# Altium schematic sheet HBridge.SchDoc: H Bridge
size Letter; DocumentNumber: 2; SheetNumber: 2; SheetTotal: 4
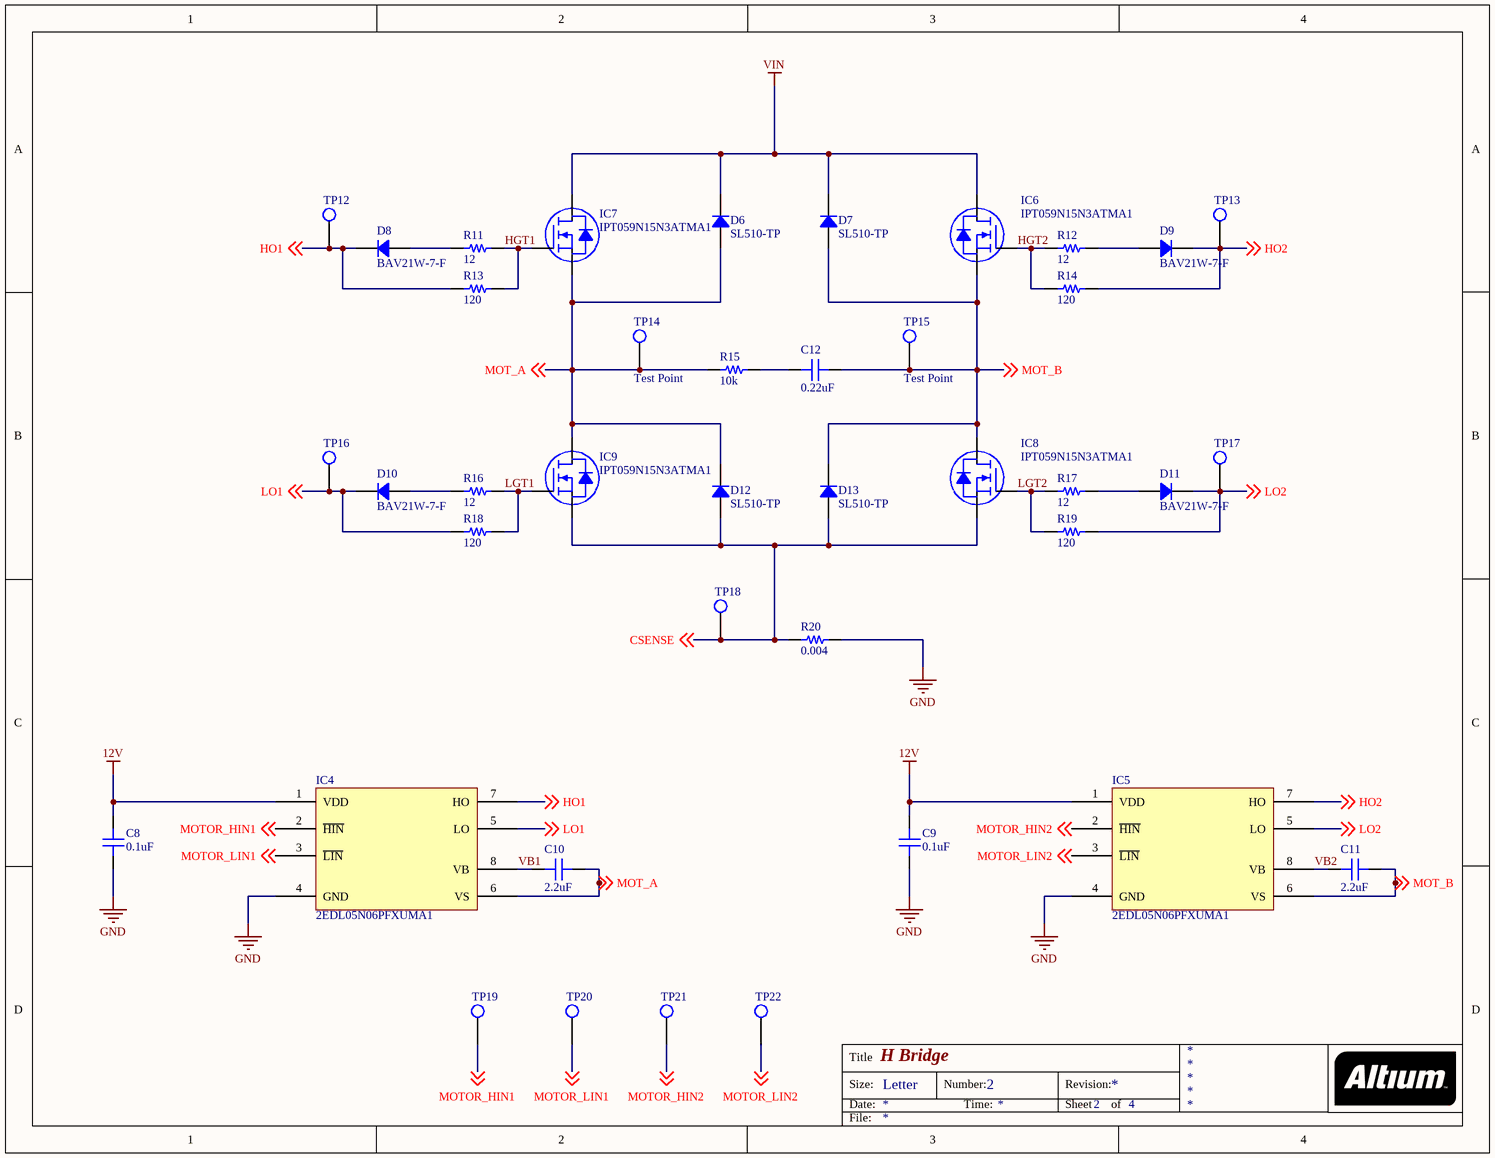
[diagram p0: HBridge.SchDoc]

## Parts
C8  0.1uF  [CAP 0603/1608]
C9  0.1uF  [CAP 0603/1608]
C10  2.2uF  [CAP 0805/2012]
C11  2.2uF  [CAP 0805/2012]
C12  0.22uF  [CAP 1206/3216]
D6  SL510-TP  [ST DO214AB SMC]
D7  SL510-TP  [ST DO214AB SMC]
D8  BAV21W-7-F  [SOD-123]
D9  BAV21W-7-F  [SOD-123]
D10  BAV21W-7-F  [SOD-123]
D11  BAV21W-7-F  [SOD-123]
D12  SL510-TP  [ST DO214AB SMC]
D13  SL510-TP  [ST DO214AB SMC]
IC4  2EDL05N06PFXUMA1  [Infineon PG-DSO-8]
IC5  2EDL05N06PFXUMA1  [Infineon PG-DSO-8]
IC6  IPT059N15N3ATMA1  [INFINEON PG-HSOF-8-1]
IC7  IPT059N15N3ATMA1  [INFINEON PG-HSOF-8-1]
IC8  IPT059N15N3ATMA1  [INFINEON PG-HSOF-8-1]
IC9  IPT059N15N3ATMA1  [INFINEON PG-HSOF-8-1]
R11  12  [RES 1206/3216]
R12  12  [RES 1206/3216]
R13  120  [RES 1206/3216]
R14  120  [RES 1206/3216]
R15  10k  [RES 0805/2012]
R16  12  [RES 1206/3216]
R17  12  [RES 1206/3216]
R18  120  [RES 1206/3216]
R19  120  [RES 1206/3216]
R20  0.004  [STACKPOLE CSR2512]
TP12  Test Point  [Test Point]  (value not drawn)  (no BOM)
TP13  Test Point  [Test Point]  (value not drawn)  (no BOM)
TP14  Test Point  [Test Point]  (no BOM)
TP15  Test Point  [Test Point]  (no BOM)
TP16  Test Point  [Test Point]  (value not drawn)  (no BOM)
TP17  Test Point  [Test Point]  (value not drawn)  (no BOM)
TP18  Test Point  [Test Point]  (value not drawn)  (no BOM)
TP19  Test Point  [Test Point]  (value not drawn)  (no BOM)
TP20  Test Point  [Test Point]  (value not drawn)  (no BOM)
TP21  Test Point  [Test Point]  (value not drawn)  (no BOM)
TP22  Test Point  [Test Point]  (value not drawn)  (no BOM)

## Nets
12V: C8.2 C9.2 IC4.1(VDD) IC5.1(VDD)
GND: C8.1 C9.1 IC4.4(GND) IC5.4(GND) R20.2
VIN: D6.2 D7.2 IC6.D IC7.D
CSENSE: D12.1 D13.1 IC8.S IC9.S R20.1 TP18.1(TP) ; off-sheet CSENSE
HGT1: IC7.G R11.2 R13.2
HGT2: IC6.G R12.1 R14.1
HO1: D8.2 IC4.7(HO) R13.1 TP12.1(TP) ; off-sheet HO1
HO2: D9.2 IC5.7(HO) R14.2 TP13.1(TP) ; off-sheet HO2
LGT1: IC9.G R16.2 R18.2
LGT2: IC8.G R17.1 R19.1
LO1: D10.2 IC4.5(LO) R18.1 TP16.1(TP) ; off-sheet LO1
LO2: D11.2 IC5.5(LO) R19.2 TP17.1(TP) ; off-sheet LO2
MOT_A: C10.1 D6.1 D12.2 IC4.6(VS) IC7.S IC9.D R15.1 TP14.1(TP) ; off-sheet MOT_A
MOT_B: C11.1 C12.2 D7.1 D13.2 IC5.6(VS) IC6.S IC8.D TP15.1(TP) ; off-sheet MOT_B
MOTOR_HIN1: IC4.2(~{HIN}) TP19.1(TP) ; off-sheet MOTOR_HIN1
MOTOR_HIN2: IC5.2(~{HIN}) TP21.1(TP) ; off-sheet MOTOR_HIN2
MOTOR_LIN1: IC4.3(~{LIN}) TP20.1(TP) ; off-sheet MOTOR_LIN1
MOTOR_LIN2: IC5.3(~{LIN}) TP22.1(TP) ; off-sheet MOTOR_LIN2
VB1: C10.2 IC4.8(VB)
VB2: C11.2 IC5.8(VB)
NetC12_1: C12.1 R15.2
NetD8_1: D8.1 R11.1
NetD9_1: D9.1 R12.2
NetD10_1: D10.1 R16.1
NetD11_1: D11.1 R17.2

## Notes on the sheet
- Title
- Size:
- Date:
- Letter
- Number:
- Time:
- Revision:
- Sheet
- of
- File:

## Library data of the parts
C8 C9 = CC0603KPX7R7BB104: CAP CER 0.1UF 16V X7R 0603; Manufacturer: Yageo; TemperatureRange: -55C ~ 125C; Tolerance: 10%; Value: 0.1uF; Part Number: CC0603KPX7R7BB104; PartId: 5262; Supplier 1: Digi-Key; Supplier Part Number 1: 311-1335-2-ND; ComponentLink1Description: Datasheet; ComponentLink1URL: http://www.yageo.com/documents/recent/UPY-GPHC_X7R_6.3V-to-50V-v12.pdf; ComponentLink2Description: Digi-Key listing; ComponentLink2URL: http://digikey.com/product-detail/en/CC0603KPX7R7BB104/311-1335-2-ND/2103073; TemperatureCoefficient: X7R; Voltage: 16V; Price: 0.0043; Type: -; Device Package: 0603 (1608 Metric)
C10 C11 = GRM219C81E225KE15D: CAP CER 2.2UF 25V X6S 0805; Manufacturer: Murata Electronics North America; TemperatureRange: -55C ~ 105C; Tolerance: 10%; Value: 2.2uF; Part Number: GRM219C81E225KE15D; PartId: 13974; Supplier 1: Digi-Key; Supplier Part Number 1: 490-7206-2-ND; ComponentLink1Description: Datasheet; ComponentLink1URL: http://www.murata.com/~/media/webrenewal/support/library/catalog/products/capacitor/mlcc/c02e.pdf; ComponentLink2Description: Digi-Key Listing; ComponentLink2URL: https://www.digikey.com/product-detail/en/murata-electronics-north-america/GRM219C81E225KE15D/490-7206-2-ND/3900464; TemperatureCoefficient: X6S; Voltage: 25V; Price: 0.0334; Device Package: 0805 (2012 Metric)
C12 = C3216X7T2E224K160AA: CAP CER 0.22UF 250V X7T 1206; Manufacturer: TDK Corporation; TemperatureRange: -55C ~ 125C; Tolerance: 10%; Value: 0.22uF; Part Number: C3216X7T2E224K160AA; PartId: 14974; Supplier 1: Digi-Key; Supplier Part Number 1: 445-7756-2-ND; ComponentLink1Description: Datasheet; ComponentLink1URL: https://product.tdk.com/info/en/catalog/datasheets/mlcc_commercial_midvoltage_en.pdf; ComponentLink2Description: Digi-Key Listing; ComponentLink2URL: https://www.digikey.com/product-detail/en/tdk-corporation/C3216X7T2E224K160AA/445-7756-2-ND/2733191; TemperatureCoefficient: X7T; Voltage: 250V; Price: 0.099; Device Package: 1206 (3216 Metric)
D6 D7 D12 D13 = SL510-TP: DIODE SCHOTTKY 100V 5A DO214AB; Manufacturer: Micro Commercial Co; Current Reverse Leakage @ Vr: 500uA @ 100V; Voltage Forward (Vf): 700mV @ 5A; Part Number: SL510-TP; PartId: 27860; Supplier 1: Digi-Key; Supplier Part Number 1: SL510-TPMSCT-ND; ComponentLink1Description: Datasheet; ComponentLink1URL: http://www.mccsemi.com/up_pdf/SL54~SL510(DO-214AB)-A.pdf; ComponentLink2Description: Digi-Key Listing; ComponentLink2URL: https://www.digikey.com/product-detail/en/micro-commercial-co/SL510-TP/SL510-TPMSCT-ND/6004849; Junction Operating Temperature: -55C ~ 150C; Price: 0.74; Type: Schottky; Device Package: DO-214AB, SMC; Voltage DC Reverse (Vr): 100V; Current Rectified: 5A
D8-D11 = BAV21W-7-F: DIODE GEN PURP 200V 200MA SOD123; Manufacturer: Diodes Incorporated; Type: Standard; Current Reverse Leakage @ Vr: 100nA @ 200V; Reverse Recovery Time (trr): 50ns; Voltage Forward (Vf): 1.25V @ 200mA; Part Number: BAV21W-7-F; PartId: 14590; Supplier 1: Digi-Key; Supplier Part Number 1: BAV21W-FDITR-ND; ComponentLink1Description: Datasheet; ComponentLink1URL: http://www.diodes.com/_files/datasheets/ds12024.pdf; ComponentLink2Description: Digi-Key Listing; ComponentLink2URL: https://www.digikey.com/product-detail/en/diodes-incorporated/BAV21W-7-F/BAV21W-FDITR-ND/717710; Junction Operating Temperature: -65C ~ 150C; Price: 0.0318; Device Package: SOD-123; Voltage DC Reverse (Vr): 200V; Current Rectified: 200mA
IC4 IC5 = 2EDL05N06PFXUMA1: IC DRIVER GATE HALF BRIDGE 8DSO; Manufacturer: Infineon Technologies; Voltage - Supply: 10 V ~ 20 V; Part Number: 2EDL05N06PFXUMA1; PartId: 21206; Supplier 1: Digi-Key; Supplier Part Number 1: 2EDL05N06PFXUMA1TR-ND; ComponentLink1Description: Datasheet; ComponentLink1URL: http://www.infineon.com/dgdl/Infineon-2EDL05x06xx-DS-v02_05-EN.pdf?fileId=db3a30433e30e4bf013e3c649ffd6c8b; ComponentLink2Description: Digi-Key Listing; ComponentLink2URL: http://www.digikey.com/product-detail/en/infineon-technologies/2EDL05N06PFXUMA1/2EDL05N06PFXUMA1TR-ND/4571868?; Price: 0.5782; Device Package: 8-SOIC (0.154", 3.90mm Width)
IC6-IC9 = IPT059N15N3ATMA1: MOSFET N-CH 150V 155A 8HSOF; Manufacturer: Infineon Technologies; Rds On (Max) at Id, Vgs: 5.9 mOhm @ 150A, 10V; Vgs(th) (Max) at Id: 4V @ 270uA; Current Continuous Drain: 155A (Tc); Part Number: IPT059N15N3ATMA1; PartId: 21207; Supplier 1: Digi-Key; Supplier Part Number 1: IPT059N15N3ATMA1CT-ND; ComponentLink1Description: Datasheet; ComponentLink1URL: http://www.infineon.com/dgdl/IPT059N15N3+G_Rev1.1.pdf?folderId=db3a304326623792012669f6bee2224b&fileId=db3a30433e9d5d11013e9e62778d0185; ComponentLink2Description: Digi-Key Listing; ComponentLink2URL: http://www.digikey.ca/product-detail/en/infineon-technologies/IPT059N15N3ATMA1/IPT059N15N3ATMA1CT-ND/4571880; Price: 9.27; Type: N-Channel; Device Package: 8-PowerSFN; Drain to Source Voltage (Vdss): 150V; Features: -
R11 R12 R16 R17 = ERJ-8GEYJ120V: RES SMD 12 OHM 5% 1/4W 1206; Manufacturer: Panasonic Electronic Components; TemperatureRange: -55C ~ 155C; TemperatureCoefficient: 200ppm/C; PowerRating: 0.25W, 1/4W; Value: 12; Part Number: ERJ-8GEYJ120V; PartId: 11899; Supplier 1: Digi-Key; Supplier Part Number 1: P12ETR-ND; ComponentLink1Description: Datasheet; ComponentLink1URL: http://industrial.panasonic.com/www-cgi/jvcr13pz.cgi?E+PZ+3+AOA0001+ERJ8GEYJ120V+7+WW; ComponentLink2Description: Digi-Key Listing; ComponentLink2URL: https://www.digikey.com/product-detail/en/panasonic-electronic-components/ERJ-8GEYJ120V/P12ETR-ND/16119; Tolerance: 5%; Price: 0.0045; Device Package: 1206 (3216 Metric)
R13 R14 R18 R19 = ERJ-8GEYJ121V: RES SMD 120 OHM 5% 1/4W 1206; Manufacturer: Panasonic Electronic Components; TemperatureRange: -55C ~ 155C; TemperatureCoefficient: 200ppm/C; PowerRating: 0.25W, 1/4W; Value: 120; Part Number: ERJ-8GEYJ121V; PartId: 11834; Supplier 1: Digi-Key; Supplier Part Number 1: P120ETR-ND; ComponentLink1Description: Datasheet; ComponentLink1URL: http://industrial.panasonic.com/www-cgi/jvcr13pz.cgi?E+PZ+3+AOA0001+ERJ8GEYJ121V+7+WW; ComponentLink2Description: Digi-Key Listing; ComponentLink2URL: https://www.digikey.com/product-detail/en/panasonic-electronic-components/ERJ-8GEYJ121V/P120ETR-ND/1567; Tolerance: 5%; Price: 0.0045; Device Package: 1206 (3216 Metric)
R15 = ERJ-6GEYJ103V: RES SMD 10K OHM 5% 1/8W 0805; Manufacturer: Panasonic Electronic Components; TemperatureRange: -55C ~ 155C; TemperatureCoefficient: 200ppm/C; PowerRating: 0.125W, 1/8W; Value: 10k; Part Number: ERJ-6GEYJ103V; PartId: 11441; Supplier 1: Digi-Key; Supplier Part Number 1: P10KATR-ND; ComponentLink1Description: Datasheet; ComponentLink1URL: http://industrial.panasonic.com/www-cgi/jvcr13pz.cgi?E+PZ+3+AOA0001+ERJ6GEYJ103V+7+WW; ComponentLink2Description: Digi-Key Listing; ComponentLink2URL: https://www.digikey.com/product-detail/en/panasonic-electronic-components/ERJ-6GEYJ103V/P10KATR-ND/83062; Tolerance: 5%; Price: 0.0032; Device Package: 0805 (2012 Metric)
R20 = ERJ-MP4MF4M0U: RES SMD 0.004 OHM 1% 1W 2512; Manufacturer: Panasonic Electronic Components; TemperatureRange: -65C ~ 170C; TemperatureCoefficient: 75ppm/C; Value: 0.004; Part Number: ERJ-MP4MF4M0U; PartId: 21258; Supplier 1: Digi-Key; Supplier Part Number 1: P19396TR-ND; ComponentLink1Description: Datasheet; ComponentLink1URL: https://industrial.panasonic.com/cdbs/www-data/pdf/RDA0000/AOA0000C263.pdf; ComponentLink2Description: Digi-Key Listing; ComponentLink2URL: https://www.digikey.com/product-detail/en/panasonic-electronic-components/ERJ-MP4MF4M0U/P19396TR-ND/6096725; Tolerance: 1%; PowerRating: 1W; Price: 0.1201; Device Package: 2512 (6432 Metric)